# EAGLE schematic tulip breakout (EAGLE 9.6.2)
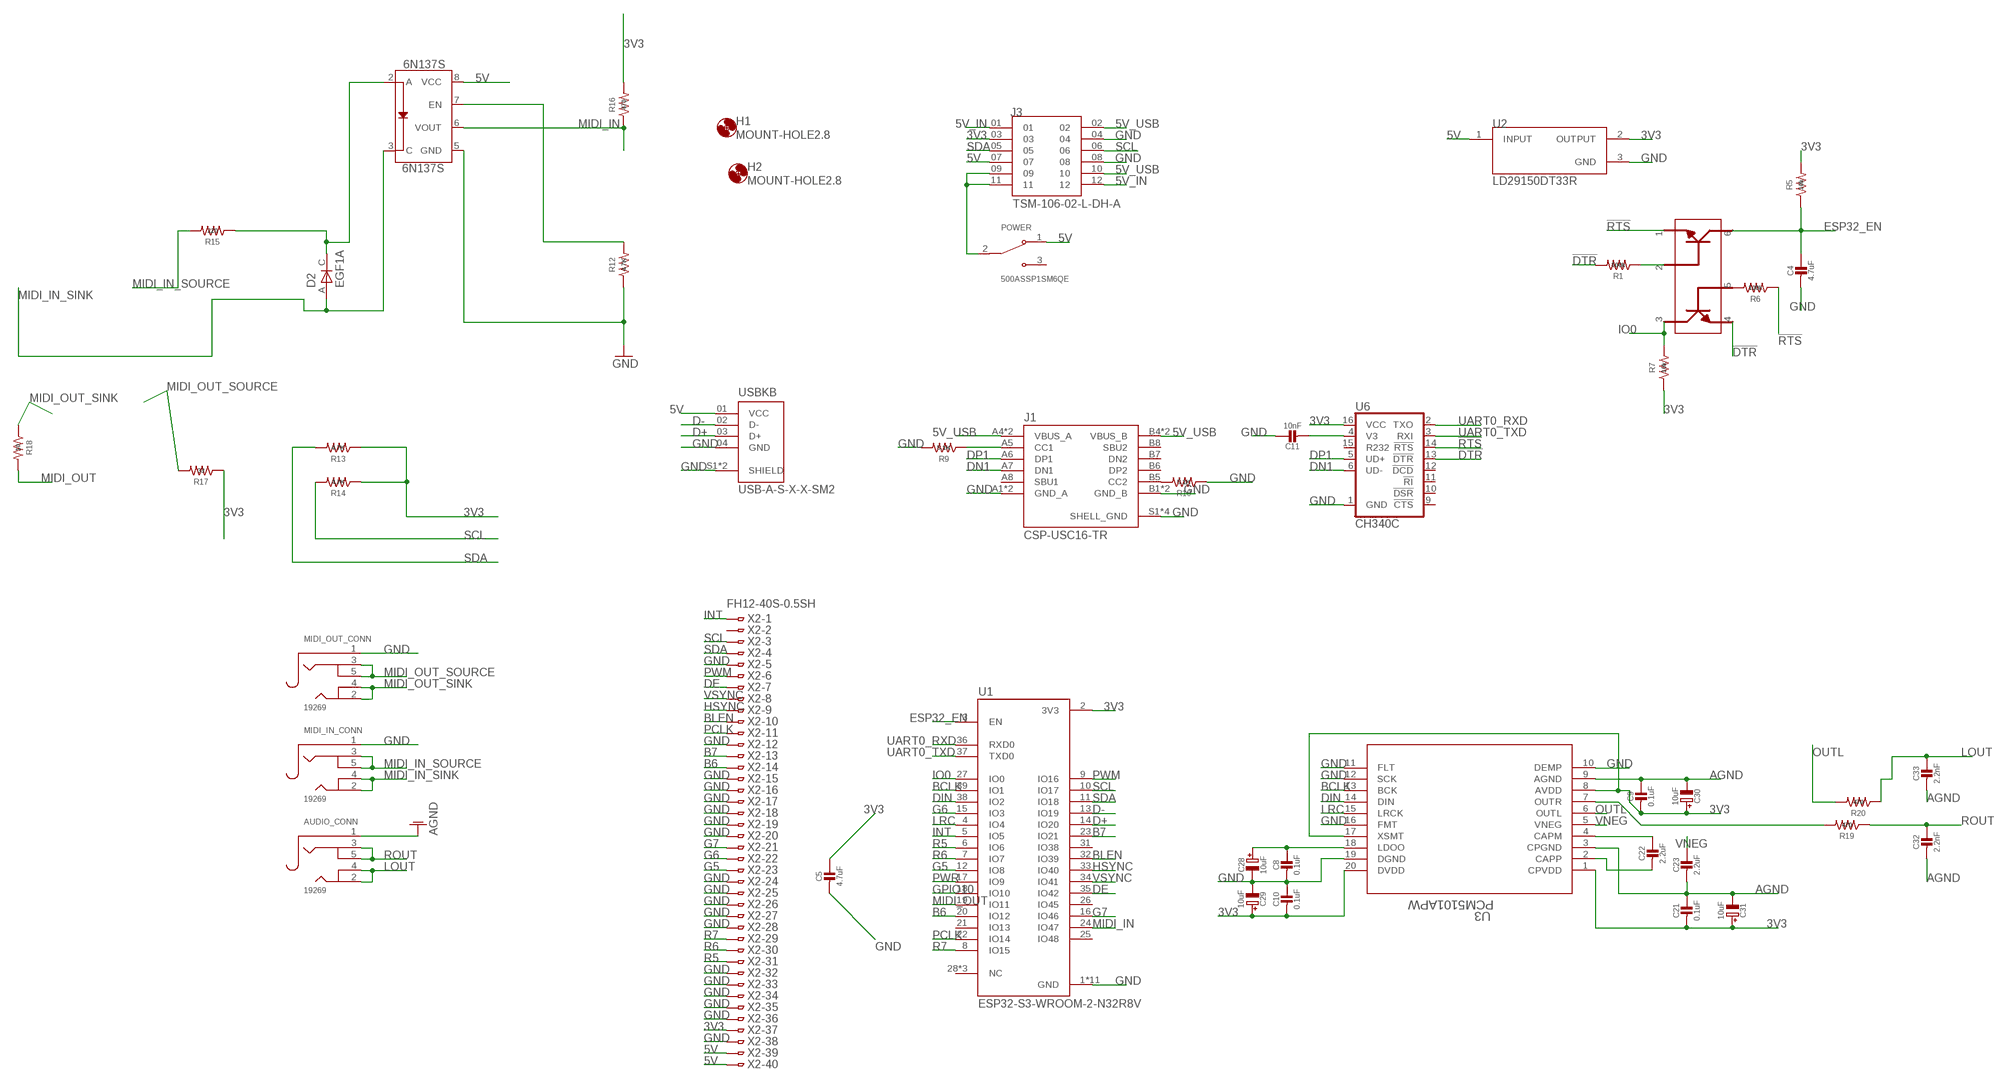
[diagram p0: schematic, sheet 1]

## Parts
6N137S  6N137S  [8-SMD]
AUDIO_CONN  19269  AUDIO_3.5MMJACK  [4UCONN_19269]
C4  4.7uF  CAP_CERAMIC0805-NOOUTLINE  [0805-NO]
C5  4.7uF  CAP_CERAMIC0805-NOOUTLINE  [0805-NO]
C8  0.1uF  CAP_CERAMIC0805-NOOUTLINE  [0805-NO]
C9  0.1uF  CAP_CERAMIC0805-NOOUTLINE  [0805-NO]
C10  0.1uF  CAP_CERAMIC0805-NOOUTLINE  [0805-NO]
C11  10nF  CAP_CERAMIC0805-NOOUTLINE  [0805-NO]
C21  0.1uF  CAP_CERAMIC0805-NOOUTLINE  [0805-NO]
C22  2.2uF  CAP_CERAMIC0805-NOOUTLINE  [0805-NO]
C23  2.2uF  CAP_CERAMIC0805-NOOUTLINE  [0805-NO]
C28  10uF  CAP_ELECTROLYTICPANASONIC_C  [PANASONIC_C]
C29  10uF  CAP_ELECTROLYTICPANASONIC_C  [PANASONIC_C]
C30  10uF  CAP_ELECTROLYTICPANASONIC_C  [PANASONIC_C]
C31  10uF  CAP_ELECTROLYTICPANASONIC_C  [PANASONIC_C]
C32  2.2nF  CAP_CERAMIC0805-NOOUTLINE  [0805-NO]
C33  2.2nF  CAP_CERAMIC0805-NOOUTLINE  [0805-NO]
D2  EGF1A  [DIOM449X264X300L114X135N]
H1  MOUNT-HOLE2.8  [2,8]
H2  MOUNT-HOLE2.8  [2,8]
J1  CSP-USC16-TR  [VALCON_CSP-USC16-TR]
J3  TSM-106-02-L-DH-A  [SAMTEC_TSM-106-02-L-DH-A]
MIDI_IN_CONN  19269  AUDIO_3.5MMJACK  [4UCONN_19269]
MIDI_OUT_CONN  19269  AUDIO_3.5MMJACK  [4UCONN_19269]
POWER  500ASSP1SM6QE  [SW_500ASSP1SM6QE]
R1  100k  R-US_R0805  [R0805]
R5  10k  R-US_R0805  [R0805]
R6  100k  R-US_R0805  [R0805]
R7  10k  R-US_R0805  [R0805]
R9  5.1K  R-US_R0805  [R0805]
R10  5.1K  R-US_R0805  [R0805]
R12  4.7K  R-US_R0805  [R0805]
R13  4.7K  R-US_R0805  [R0805]
R14  4.7K  R-US_R0805  [R0805]
R15  220  R-US_R0805  [R0805]
R16  470  R-US_R0805  [R0805]
R17  33  R-US_R0805  [R0805]
R18  10  R-US_R0805  [R0805]
R19  470  R-US_R0805  [R0805]
R20  470  R-US_R0805  [R0805]
RESET  MBT3904DW1T1G  [SOT236]
U1  ESP32-S3-WROOM-2-N32R8V  [XCVR_ESP32-S3-WROOM-2-N32R8V]
U2  LD29150DT33R  [DPAK456P972X240-3N]
U3  PCM5101APW  [PW20_TEX]
U6  CH340C  [SO016]
USBKB  USB-A-S-X-X-SM2  [SAMTEC_USB-A-S-X-X-SM2]
X2  FH12-40S-0.5SH  [FH12-40S-0.5SH]

## Nets
3V3: C5.1 C9.2 C10.2 C21.2 C29.+ C30.+ C31.+ J3.03 R5.2 R7.1 R13.1 R14.1 R16.2 R17.1 U1.2(3V3) U2.2(OUTPUT) U3.1(CPVDD) U3.8(AVDD) U3.17(XSMT) U3.20(DVDD) U6.16(VCC) X2.37
5V: 6N137S.8(VCC) J3.07 POWER.1(NC) U2.1(INPUT) USBKB.01(VCC) X2.39 X2.40
5V_IN: J3.01 J3.12
5V_USB: J1.A4(VBUS_A) J1.A9(VBUS_A) J1.B4(VBUS_B) J1.B9(VBUS_B) J3.02 J3.10
!DTR: R1.2 RESET.4 U6.13(!DTR)
!RTS: R6.1 RESET.1 U6.14(!RTS)
AGND: AUDIO_CONN.1 C9.1 C21.1 C23.2 C30.- C31.- C32.2 C33.2 U3.3(CPGND) U3.9(AGND)
B6: U1.20(IO12) X2.14
B7: U1.23(IO21) X2.13
BCLK: U1.39(IO1) U3.13(BCK)
BLEN: U1.32(IO39) X2.10
D+: U1.14(IO20) USBKB.03(D+)
D-: U1.13(IO19) USBKB.02(D-)
DE: U1.35(IO42) X2.7
DIN: U1.38(IO2) U3.14(DIN)
DN1: J1.A7(DN1) U6.6(UD-)
DP1: J1.A6(DP1) U6.5(UD+)
ESP32_EN: C4.1 R5.1 RESET.6 U1.3(EN)
G5: U1.12(IO8) X2.23
G6: U1.15(IO3) X2.22
G7: U1.16(IO46) X2.21
GND: 6N137S.5(GND) C4.2 C5.2 C8.2 C10.1 C11.1 C28.- C29.- J1.A1(GND_A) J1.A12(GND_A) J1.B1(GND_B) J1.B12(GND_B) J1.S1(SHELL_GND) J1.S2(SHELL_GND) J1.S3(SHELL_GND) J1.S4(SHELL_GND) J3.04 J3.08 MIDI_IN_CONN.1 MIDI_OUT_CONN.1 R9.2 R10.1 R12.1 U1.1(GND) U1.40(GND) U1.41_1(GND) U1.41_2(GND) U1.41_3(GND) U1.41_4(GND) U1.41_5(GND) U1.41_6(GND) U1.41_7(GND) U1.41_8(GND) U1.41_9(GND) U2.3(GND) U3.10(DEMP) U3.11(FLT) U3.12(SCK) U3.16(FMT) U3.19(DGND) U6.1(GND) USBKB.04(GND) USBKB.S1(SHIELD) USBKB.S2(SHIELD) X2.5 X2.12 X2.15 X2.16 X2.17 X2.18 X2.19 X2.20 X2.24 X2.25 X2.26 X2.27 X2.28 X2.32 X2.33 X2.34 X2.35 X2.36 X2.38
GPIO10: U1.18(IO10)
HSYNC: U1.33(IO40) X2.9
INT: U1.5(IO5) X2.1
IO0: R7.2 RESET.3 U1.27(IO0)
LOUT: AUDIO_CONN.2 AUDIO_CONN.4 C33.1 R20.1
LRC: U1.4(IO4) U3.15(LRCK)
MIDI_IN: 6N137S.6(VOUT) R16.1 U1.24(IO47)
MIDI_IN_SINK: 6N137S.3(C) D2.A MIDI_IN_CONN.2 MIDI_IN_CONN.4
MIDI_IN_SOURCE: MIDI_IN_CONN.3 MIDI_IN_CONN.5 R15.2
MIDI_OUT: R18.2 U1.19(IO11)
MIDI_OUT_SINK: MIDI_OUT_CONN.2 MIDI_OUT_CONN.4 R18.1
MIDI_OUT_SOURCE: MIDI_OUT_CONN.3 MIDI_OUT_CONN.5 R17.2
N$1: R1.1 RESET.2
N$2: R6.2 RESET.5
N$3: J1.B5(CC2) R10.2
N$7: C8.1 C28.+ U3.18(LDOO)
N$8: R19.2 U3.7(OUTR)
N$10: J3.09 J3.11 POWER.2(COM)
N$16: C22.1 U3.4(CAPM)
N$18: C22.2 U3.2(CAPP)
N$30: 6N137S.2(A) D2.C R15.1
N$32: 6N137S.7(EN) R12.2
N$38: C11.2 U6.4(V3)
N$42: J1.A5(CC1) R9.1
OUTL: R20.2 U3.6(OUTL)
PCLK: U1.22(IO14) X2.11
PWM: U1.9(IO16) X2.6
PWR: U1.17(IO9)
R5: U1.6(IO6) X2.31
R6: U1.7(IO7) X2.30
R7: U1.8(IO15) X2.29
ROUT: AUDIO_CONN.3 AUDIO_CONN.5 C32.1 R19.1
SCL: J3.06 R14.2 U1.10(IO17) X2.3
SDA: J3.05 R13.2 U1.11(IO18) X2.4
UART0_RXD: U1.36(RXD0) U6.2(TXO)
UART0_TXD: U1.37(TXD0) U6.3(RXI)
VNEG: C23.1 U3.5(VNEG)
VSYNC: U1.34(IO41) X2.8
Unconnected: J1.A8(SBU1) J1.B6(DP2) J1.B7(DN2) J1.B8(SBU2) POWER.3(NO) U1.21(IO13) U1.25(IO48) U1.26(IO45) U1.28(NC) U1.29(NC) U1.30(NC) U1.31(IO38) U6.9(!CTS) U6.10(!DSR) U6.11(!RI) U6.12(!DCD) U6.15(R232) X2.2

## Library data of the parts
6N137S = 6N137S:6N137S: Lite-On 6N137 - High Speed Opto Isolator Opto isolator capable of data rates up to 10MBd Check availability <https://pricing.snapeda.com/parts/6N137S/Lite-On%20Inc./view-part?ref=eda>; AVAILABILITY: In Stock; DESCRIPTION: Logic Output Optoisolator 15MBd Open Collector 5000Vrms 1 Channel 10kV/µs CMTI 8-SMD; MF: Lite-On Inc.; MP: 6N137S; PACKAGE: SMD-8 Lite-On Inc.; PRICE: None; PURCHASE-URL: https://pricing.snapeda.com/search/part/6N137S/?ref=eda
AUDIO_CONN MIDI_IN_CONN MIDI_OUT_CONN = microbuilder:AUDIO_3.5MMJACK: 3.5MM Audio Jack These are normally connected as follows, from left-to right on the schematic symbol above: Tip: Left Audio Inner Ring: Right Audio Shell: Common/GND
C4 C5 C8-C11 C21-C23 C32 C33 = microbuilder:CAP_CERAMIC: Ceramic Capacitors For new designs, use the packages preceded by an '_' character since they are more reliable: The following footprints should be used on most boards: _0402 - Standard footprint for regular board layouts _0603 - Standard footprint for regular board layouts _0805 - Standard footprint for regular board layouts _1206 - Standard footprint for regular board layouts For extremely tight-pitch boards where space is at a premium, the following 'micro-pitch' footprints can be used (smaller pads, no silkscreen outline, etc.): _0402MP - Micro-pitch footprint for very dense/compact boards _0603MP - Micro-pitch footprint for very dense/compact boards _0805MP - Micro-pitch footprint for very dense/compact boards _1206MP - Micro-pitch footprint for very dense/compact boards
C28-C31 = microbuilder:CAP_ELECTROLYTIC: Electrolytic Capacitors SMT PANASONIC_C - Size C Panasonic Electrolytic Aluminum Capacitor 47µF 16V 20% Electrolytic Capacitor [Digikey: PCE3890TR-ND] PANASONIC_D - Size D Panasonic Electrolytic Aluminum Capacitor 100µF 25V 20% Electrolytic Capacitor [Digikey: PCE3898TR-ND] PTH 3.5 mm grid, 8 mm diameter ... 3.5 mm grid, 10 mm diameter ...
D2 = EGF1A:EGF1A: EGF1A Series 1 A 100 V 50 ns Surface Mount Fast Recovery Rectifier - DO-214AC Check availability <https://pricing.snapeda.com/parts/EGF1A/ON%20Semiconductor/view-part?ref=eda>; AVAILABILITY: In Stock; DESCRIPTION: Diode Standard 50 V 1A Surface Mount DO-214AC (SMA); MF: ON Semiconductor; MP: EGF1A; PACKAGE: SMA-2 ON Semiconductor; PRICE: None; PURCHASE-URL: https://pricing.snapeda.com/search/part/EGF1A/?ref=eda
H1 H2 = holes:MOUNT-HOLE: MOUNTING HOLE with drill center marker
J1 = CSP-USC16-TR:CSP-USC16-TR: CSP-USC16-TR Valcon USB Type C Surface Mount PCB Socket Check availability <https://pricing.snapeda.com/parts/CSP-USC16-TR/Valcon/view-part?ref=eda>; AVAILABILITY: In Stock; DESCRIPTION: CSP-USC16-TR Valcon USB Type C Surface Mount PCB Socket; MF: Valcon; MP: CSP-USC16-TR; PACKAGE: None; PRICE: None; PURCHASE-URL: https://pricing.snapeda.com/search/part/CSP-USC16-TR/?ref=eda
J3 = TSM-106-02-L-DH-A:TSM-106-02-L-DH-A; DESCRIPTION: Connector Header Surface Mount, Right Angle 12 position 0.100 (2.54mm); DIGI-KEY_PART_NUMBER: 612-TSM-106-02-L-DH-A-ND; MF: Samtec; MP: TSM-106-02-L-DH-A; PACKAGE: None; PURCHASE-URL: https://pricing.snapeda.com/search/part/TSM-106-02-L-DH-A/?ref=eda
POWER = 500ASSP1SM6QE:500ASSP1SM6QE; DESCRIPTION: Slide Switch SPDT Surface Mount, Right Angle; DIGI-KEY_PART_NUMBER: EG5810TR-ND; MF: E-Switch; MP: 500ASSP1SM6QE; PACKAGE: None; PURCHASE-URL: https://pricing.snapeda.com/search/part/500ASSP1SM6QE/?ref=eda
R1 R5-R7 R9 R10 R12-R20 = adafruit:R-US_: RESISTOR, American symbol
RESET = MBT3904DW1T1G:MBT3904DW1T1G: Check availability <https://pricing.snapeda.com/parts/MBT3904DW1T1G/ON%20Semiconductor/view-part?ref=eda>; AVAILABILITY: In Stock; DESCRIPTION: Bipolar (BJT) Transistor Array 2 NPN (Dual) 40V 200mA 300MHz 150mW Surface Mount SC-88/SC70-6/SOT-363; MF: ON Semiconductor; MP: MBT3904DW1T1G; PACKAGE: SC-88-6 ON Semiconductor; PRICE: None; PURCHASE-URL: https://pricing.snapeda.com/search/part/MBT3904DW1T1G/?ref=eda
U1 = ESP32-S3-WROOM-2-N32R8V:ESP32-S3-WROOM-2-N32R8V: Check availability <https://pricing.snapeda.com/parts/ESP32-S3-WROOM-2-N32R8V/Espressif%20Systems/view-part?ref=eda>; AVAILABILITY: In Stock; DESCRIPTION: Bluetooth, WiFi 802.11b/g/n, Bluetooth v5.0 Transceiver Module 2.4GHz PCB Trace Surface Mount; MF: Espressif Systems; MP: ESP32-S3-WROOM-2-N32R8V; PACKAGE: Package; PRICE: None; PURCHASE-URL: https://pricing.snapeda.com/search/part/ESP32-S3-WROOM-2-N32R8V/?ref=eda
U2 = LD29150DT33R:LD29150DT33R: LD29150 Series 1.5 A 3.3 V Fixed Output SMT LDO Voltage Regulator - TO-252; DESCRIPTION: Linear Voltage Regulator IC Positive Fixed 1 Output 1.5A DPAK; DIGI-KEY_PART_NUMBER: 497-1496-2-ND; MF: STMicroelectronics; MP: LD29150DT33R; PACKAGE: TO-252 STMicroelectronics; PURCHASE-URL: https://pricing.snapeda.com/search/part/LD29150DT33R/?ref=eda
U3 = pcm5101apw:PCM5101APW; COPYRIGHT: Copyright (C) 2022 Ultra Librarian. All rights reserved.; DIGI-KEY_PART_NUMBER_1: PCM5101APW-ND; MANUFACTURER_PART_NUMBER: PCM5101APW; MFR_NAME: Texas Instruments
U6 = SparkFun-IC-Comms:CH340C; PROD_ID: IC-14038
USBKB = USB-A-S-X-X-SM2:USB-A-S-X-X-SM2: USB-A (USB TYPE-A) USB 2.0 Receptacle Connector 4 Position Surface Mount, Right Angle; Through Hole Check availability <https://pricing.snapeda.com/parts/USB-A-S-F-W-SM2-TR/Samtec/view-part?ref=eda>; AVAILABILITY: In Stock; DESCRIPTION: USB-A (USB TYPE-A) USB 2.0 Receptacle Connector 4 Position Surface Mount, Right Angle; MF: Samtec; MP: USB-A-S-F-W-SM2-TR; PACKAGE: None; PRICE: None; PURCHASE-URL: https://pricing.snapeda.com/search/part/USB-A-S-F-W-SM2-TR/?ref=eda
X2 = con-hirose:FH12-40S-0.5S: 0.5mm Pitch Connectors For FPC/FFC Source: Data sheet <http://www.hirose.co.jp/cataloge_hp/e58605370.pdf>; MPN: FH12-40S-0.5SH(55); OC_FARNELL: 1324556; OC_NEWARK: 34M6178

## Net classes
1 power: width 0.178 mm